# Altium schematic sheet Keyboard_Buttons.SchDoc
size A4; MPS_Contact: www.monolithicpower.com
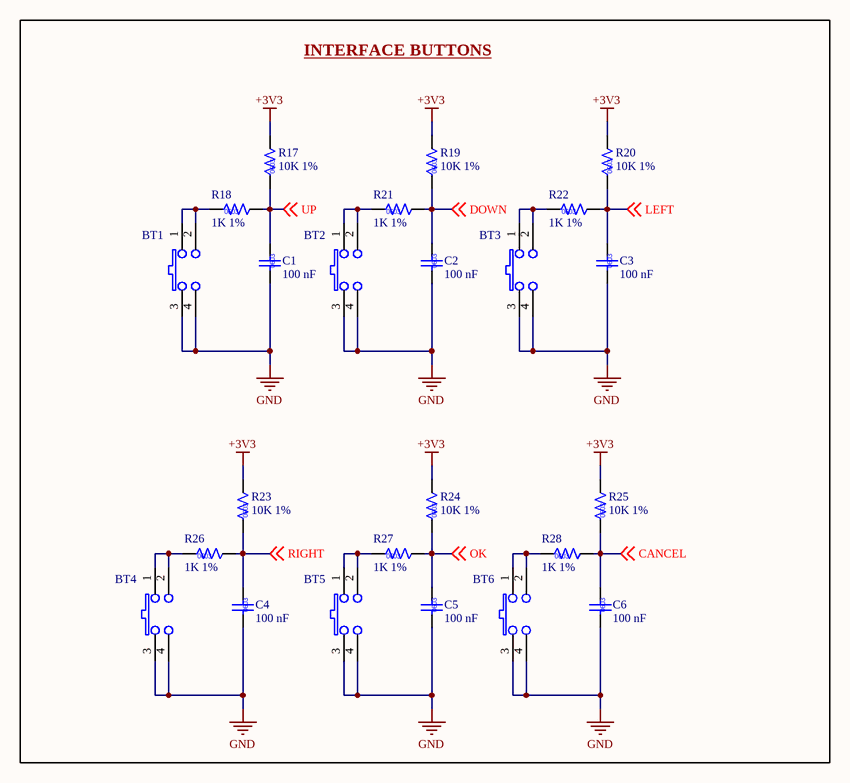
[diagram p0: Keyboard_Buttons.SchDoc]

## Parts
BT1  TS14-1212-60-BK-260-SCR-D  [TS14121260BK260SCRD]  (value not drawn)
BT2  TS14-1212-60-BK-260-SCR-D  [TS14121260BK260SCRD]  (value not drawn)
BT3  TS14-1212-60-BK-260-SCR-D  [TS14121260BK260SCRD]  (value not drawn)
BT4  TS14-1212-60-BK-260-SCR-D  [TS14121260BK260SCRD]  (value not drawn)
BT5  TS14-1212-60-BK-260-SCR-D  [TS14121260BK260SCRD]  (value not drawn)
BT6  TS14-1212-60-BK-260-SCR-D  [TS14121260BK260SCRD]  (value not drawn)
C1  100 nF  [CC/NM 0603]
C2  100 nF  [CC/NM 0603]
C3  100 nF  [CC/NM 0603]
C4  100 nF  [CC/NM 0603]
C5  100 nF  [CC/NM 0603]
C6  100 nF  [CC/NM 0603]
R17  10K 1%  [CC/NM 0603]
R18  1K 1%  [CC/NM 0603]
R19  10K 1%  [CC/NM 0603]
R20  10K 1%  [CC/NM 0603]
R21  1K 1%  [CC/NM 0603]
R22  1K 1%  [CC/NM 0603]
R23  10K 1%  [CC/NM 0603]
R24  10K 1%  [CC/NM 0603]
R25  10K 1%  [CC/NM 0603]
R26  1K 1%  [CC/NM 0603]
R27  1K 1%  [CC/NM 0603]
R28  1K 1%  [CC/NM 0603]

## Blocks framed on the sheet
INTERFACE BUTTONS: BT1-BT6 C1-C6 R17-R28

## Nets
+3V3: R17.2 R19.2 R20.2 R23.2 R24.2 R25.2
GND: BT1.3 BT1.4 BT2.3 BT2.4 BT3.3 BT3.4 BT4.3 BT4.4 BT5.3 BT5.4 BT6.3 BT6.4 C1.1 C2.1 C3.1 C4.1 C5.1 C6.1
CANCEL: C6.2 R25.1 R28.2 ; off-sheet CANCEL
DOWN: C2.2 R19.1 R21.2 ; off-sheet DOWN
LEFT: C3.2 R20.1 R22.2 ; off-sheet LEFT
OK: C5.2 R24.1 R27.2 ; off-sheet OK
RIGHT: C4.2 R23.1 R26.2 ; off-sheet RIGHT
UP: C1.2 R17.1 R18.2 ; off-sheet UP
NetBT1_1: BT1.1 BT1.2 R18.1
NetBT2_1: BT2.1 BT2.2 R21.1
NetBT3_1: BT3.1 BT3.2 R22.1
NetBT4_1: BT4.1 BT4.2 R26.1
NetBT5_1: BT5.1 BT5.2 R27.1
NetBT6_1: BT6.1 BT6.2 R28.1

## Notes on the sheet
- Engineer:
- Designed for:
- File Name:
- Project Name:
- Mod. Date:
- Sheet:
- Drawn By:
- Ref:
- of
- Rev:
- Contact:
- Monolithic Power Systems

## Library data of the parts
BT1-BT6 = TS14-1212-60-BK-260-SCR-D: Interruptores táctiles 12 x 12 mm 6 mm 260 gf Short Crimped Black Through Hole SPST; Manufacturer: Same Sky; DrownBy: Xavier Rocher; Datasheet: https://www.mouser.es/datasheet/3/6118/1/ts14.pdf; Package: Through Hole; Supplier 1: Digikey; Supplier  Part Number 1: 2223-TS14-1212-60-BK-260-SCR-D-ND; Supplier 2: Mouser; Supplier  Part Number 2: 179-TS14121260260SCR; Manufacturer Part Number: TS14-1212-60-BK-260-SCR-D; Value: TS14-1212-60-BK-260-SCR-D
C1-C6 = KGM15AV51E104ZM: / 0.1 µF -20%, +80% 25V Ceramic Capacitor Y5V (F) 0603 (1608 Metric); Manufacturer: KYOCERA AVX; DrownBy: Xavier Rocher; Datasheet: https://datasheets.kyocera-avx.com/KGM_Y5V.pdf; Package: 0603; Supplier 1: Digikey; Supplier  Part Number 1: 581-KGM15AV51E104ZM; Supplier 2: Mouser; Supplier  Part Number 2: 478-KGM15AV51E104ZMTR-ND; Manufacturer Part Number: KGM15AV51E104ZM; Value: 100 nF
R17 R19 R20 R23-R25 = AC0603FR-0710KL: Manufacturer: YAGEO; DrownBy: Xavier Rocher; Package: 0603; Supplier 1: Farnell; Supplier  Part Number 1: 2363472; Supplier 2: Mouser; Supplier  Part Number 2: 603-AC0603FR-0710KL; Manufacturer Part Number: AC0603FR-0710KL; Value: 10K 1%
R18 R21 R22 R26-R28 = RT0603BRD101KL: Manufacturer: YAGEO; DrownBy: Xavier Rocher; Package: 0603; Supplier 1: Farnell; Supplier  Part Number 1: 3496584; Supplier 2: Mouser; Supplier  Part Number 2: 603-RT0603BRD101KL; Manufacturer Part Number: RT0603BRD101KL; Value: 1K 1%